# Altium schematic sheet HFX LFX.SchDoc
size A; SheetNumber: 4; SheetTotal: 15
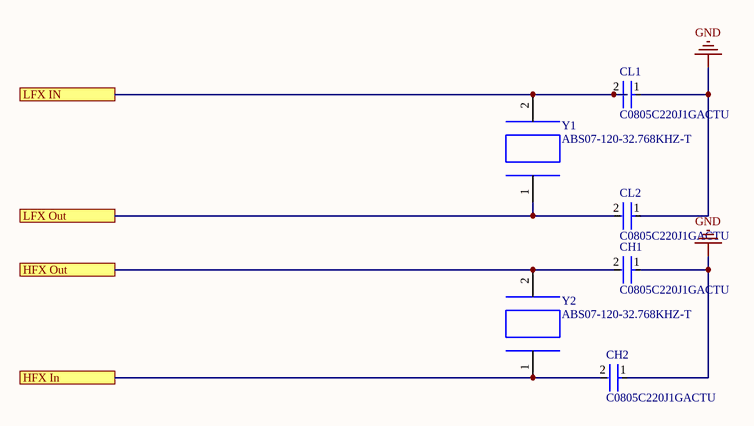
[diagram p0: HFX LFX.SchDoc]

## Parts
CH1  C0805C220J1GACTU  [FP-C0805C-DN-MFG]
CH2  C0805C220J1GACTU  [FP-C0805C-DN-MFG]
CL1  C0805C220J1GACTU  [FP-C0805C-DN-MFG]
CL2  C0805C220J1GACTU  [FP-C0805C-DN-MFG]
Y1  ABS07-120-32.768KHZ-T  [XTAL_ABS07-120-32.768KHZ-T]
Y2  ABS07-120-32.768KHZ-T  [XTAL_ABS07-120-32.768KHZ-T]

## Ports
HFX In, HFX Out, LFX IN, LFX Out

## Nets
GND: CH1.1 CH2.1 CL1.1 CL2.1
HFX In: CH2.2 Y2.1 ; port HFX In
HFX Out: CH1.2 Y2.2 ; port HFX Out
LFX IN: CL1.2 Y1.2 ; port LFX IN
LFX Out: CL2.2 Y1.1 ; port LFX Out

## Library data of the parts
CH1 CH2 CL1 CL2 = CMP-2007-00448-2: CAP CER 22PF 100V 5% NP0 0805; Manufacturer: KEMET; Temperature Coefficient: 30ppm/°C; Tolerance: 0.05; Temperature Characteristic: C0G; Value: 22 pF; RoHS: TRUE; ComponentLink2URL: https://content.kemet.com/datasheets/KEM_C1003_C0G_SMD.pdf; Capacitance: 22 pF; Material: Ceramic; Mouser Description: Multilayer Ceramic Capacitor, C Series, 22 Pf, - 5%, C0g / Np0, 100 V, 0805 [2012 Metric] Rohs Compliant: Yes; Digikey Description: CAP CER 22PF 100V 5% NP0 0805; Octopart: https://octopart.com/c0805c220j1gactu-kemet-3791395; Device Class L3: Ceramic Capacitors; Device Class L2: Capacitors; Voltage Rating: 100 V; Temperature Range Low: -55°C; Ipc Land Pattern Name: CAPC200125X78; Lead Free: Yes; ComponentLink2Description: Datasheet; Manufacturer Part Number: C0805C220J1GACTU; Category: Cap; Temperature: -55°C to +125°C; Package: C0805C-DN; Device Class L1: Passive Components; Temperature Range High: +125°C; Height: 0.88mm; Automotive: No
Y1 Y2 = ABS07-120-32.768KHZ-T: 32.768kHz Â±20ppm Crystal 6pF 55 kOhms 2-SMD, No Lead; MF: Abracon; Value: *; SnapEDA_Link: https://www.snapeda.com/parts/ABS07-120-32.768KHZ-T/Abracon%20LLC/view-part/330478/?ref=snap; Package: SMD-2 Abracon LLC; MP: ABS07-120-32.768KHZ-T; Digi-Key_Purchase_URL: https://www.digikey.com/product-detail/en/abracon-llc/ABS07-120-32.768KHZ-T/535-11937-1-ND/3724046?utm_source=snapeda&utm_medium=aggregator&utm_campaign=symbol; Digi-Key_Part_Number: 535-11937-1-ND